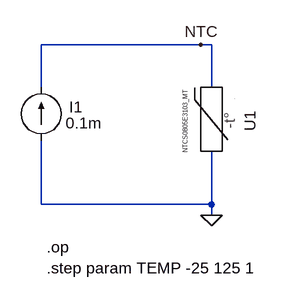
[diagram p0: schematic NTC_10K.asc]
NTC_10K.asc, the LTspice schematic file:
Version 4.1
SHEET 1 1848 836
WIRE -416 64 -656 64
WIRE -400 64 -416 64
WIRE -656 128 -656 64
WIRE -400 128 -400 64
WIRE -656 304 -656 208
WIRE -400 304 -400 224
WIRE -400 304 -656 304
WIRE -400 320 -400 304
FLAG -400 320 0
FLAG -416 64 NTC
SYMBOL current -656 208 R180
WINDOW 0 -62 50 Left 2
WINDOW 3 -91 26 Left 2
WINDOW 123 0 0 Left 0
WINDOW 39 0 0 Left 0
SYMATTR InstName I1
SYMATTR Value 0.1m
SYMBOL MyLib\\Sensor_Thermistor_NTC\\_NTC_Vishay1 -400 176 R90
SYMATTR InstName U1
TEXT -648 368 Left 2 !.op
TEXT -648 400 Left 2 !.step param TEMP -25 125 1

The netlist it stands for:
* NTC_10K.asc
I1 0 NTC 0.1m
X§U1 NTC 0 NTCS0805E3103_MT TR=0 TB=0  ; pins RN Rp
.op
.step param TEMP -25 125 1
.lib MyLib/Sensor_Thermistor_NTC/_NTC_Vishay1.lib
.backanno
.end